# EAGLE schematic stb_v10_panels (EAGLE 6.1)
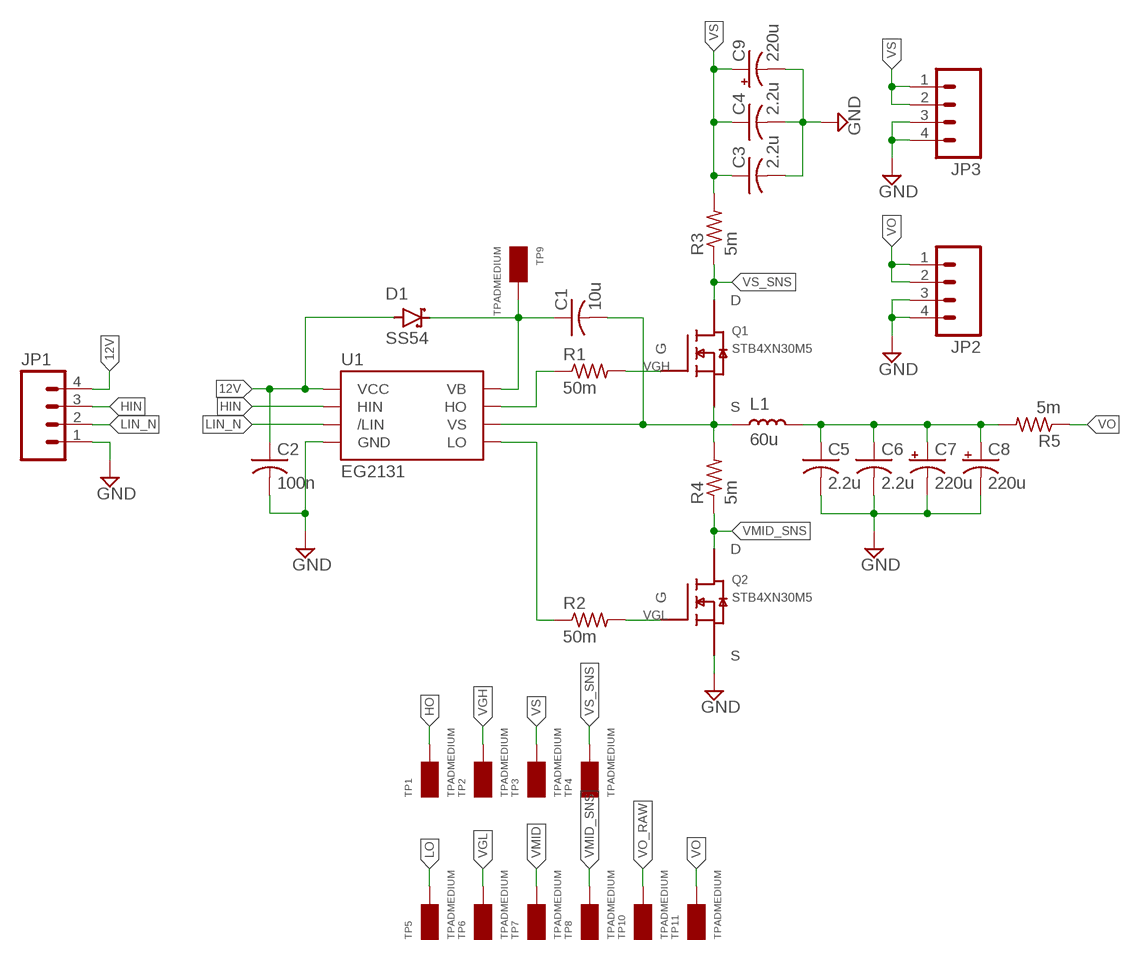
[diagram p0: schematic, sheet 1]

## Parts
C1  10u  C-USC0603  [C0603]
C2  100n  C-USC0603  [C0603]
C3  2.2u  C-USC1210  [C1210]
C4  2.2u  C-USC1210  [C1210]
C5  2.2u  C-USC1210  [C1210]
C6  2.2u  C-USC1210  [C1210]
C7  220u  CPOL-USE5-13  [E5-13]
C8  220u  CPOL-USE5-13  [E5-13]
C9  220u  CPOL-USE5-13  [E5-13]
D1  SS54  [SMA]
JP1  M04PTH  [1X04]
JP2  M04PTH  [1X04]
JP3  M04PTH  [1X04]
L1  60u  INDUCTOR10A  [INDUCTOR_10A_8.2MMX21MM]
Q1  STB4XN30M5  [D2PAK-ST]
Q2  STB4XN30M5  [D2PAK-ST]
R1  50m  R-US_R0603  [R0603]
R2  50m  R-US_R0603  [R0603]
R3  5m  R-US_R2512  [R2512]
R4  5m  R-US_R2512  [R2512]
R5  5m  R-US_R2512  [R2512]
TP1  TPADMEDIUM  [TPAD_MED]
TP2  TPADMEDIUM  [TPAD_MED]
TP3  TPADMEDIUM  [TPAD_MED]
TP4  TPADMEDIUM  [TPAD_MED]
TP5  TPADMEDIUM  [TPAD_MED]
TP6  TPADMEDIUM  [TPAD_MED]
TP7  TPADMEDIUM  [TPAD_MED]
TP8  TPADMEDIUM  [TPAD_MED]
TP9  TPADMEDIUM  [TPAD_MED]
TP10  TPADMEDIUM  [TPAD_MED]
TP11  TPADMEDIUM  [TPAD_MED]
U1  EG2131  [8-SOIC]

## Nets
12V: C2.1 D1.A(ANODE) JP1.4 U1.1(VCC)
GND: C2.2 C3.2 C4.2 C5.2 C6.2 C7.- C8.- C9.- JP1.1 JP2.3 JP2.4 JP3.3 JP3.4 Q2.3-S(S) U1.4(GND)
HIN: JP1.3 U1.2(HIN)
HO: R1.1 TP1.1 U1.7(HO)
LIN_N: JP1.2 U1.3(/LIN)
LO: R2.1 TP5.1 U1.5(LO)
VBST: C1.1 D1.K(CATHODE) TP9.1 U1.8(VB)
VGH: Q1.1-G(G) R1.2 TP2.1
VGL: Q2.1-G(G) R2.2 TP6.1
VMID: C1.2 L1.P$1 Q1.3-S(S) R4.2 TP7.1 U1.6(VS)
VMID_SNS: Q2.2-D(D) R4.1 TP8.1
VO: JP2.1 JP2.2 R5.1 TP11.1
VO_RAW: C5.1 C6.1 C7.+ C8.+ L1.P$2 R5.2 TP10.1
VS: C3.1 C4.1 C9.+ JP3.1 JP3.2 R3.2 TP3.1
VS_SNS: Q1.2-D(D) R3.1 TP4.1

## Library data of the parts
C1-C6 = resistor:C-US: CAPACITOR, American symbol
C7-C9 = resistor:CPOL-US: POLARIZED CAPACITOR, American symbol
D1 = custom:SS54: Diode Schottky 40V 5A 1mA Ir 0.55Vf
JP1-JP3 = SparkFun:M04: Header 4 Standard 4-pin 0.1" header. Use with straight break away headers (SKU : PRT-00116), right angle break away headers (PRT-00553), swiss pins (PRT-00743), machine pins (PRT-00117), and female headers (PRT-00115). Molex polarized connector foot print use with SKU : PRT-08231 with associated crimp pins and housings. 1MM SMD Version SKU: PRT-10208
L1 = custom:INDUCTOR
Q1 Q2 = custom:STB4XN30M5: N-channel MOSFET 300V 53A 0.037Ω D2PAK 10Vgs
R1-R5 = resistor:R-US_: RESISTOR, American symbol
TP1-TP11 = custom:TPAD
U1 = custom:EG2131: IC MOSFET IGBT Driver Synchronous Dual N-Channel Bootstrap 1/1.5A 300V